# Altium project DC_CDI_Honda_CX500_rev2.0.PrjPcb
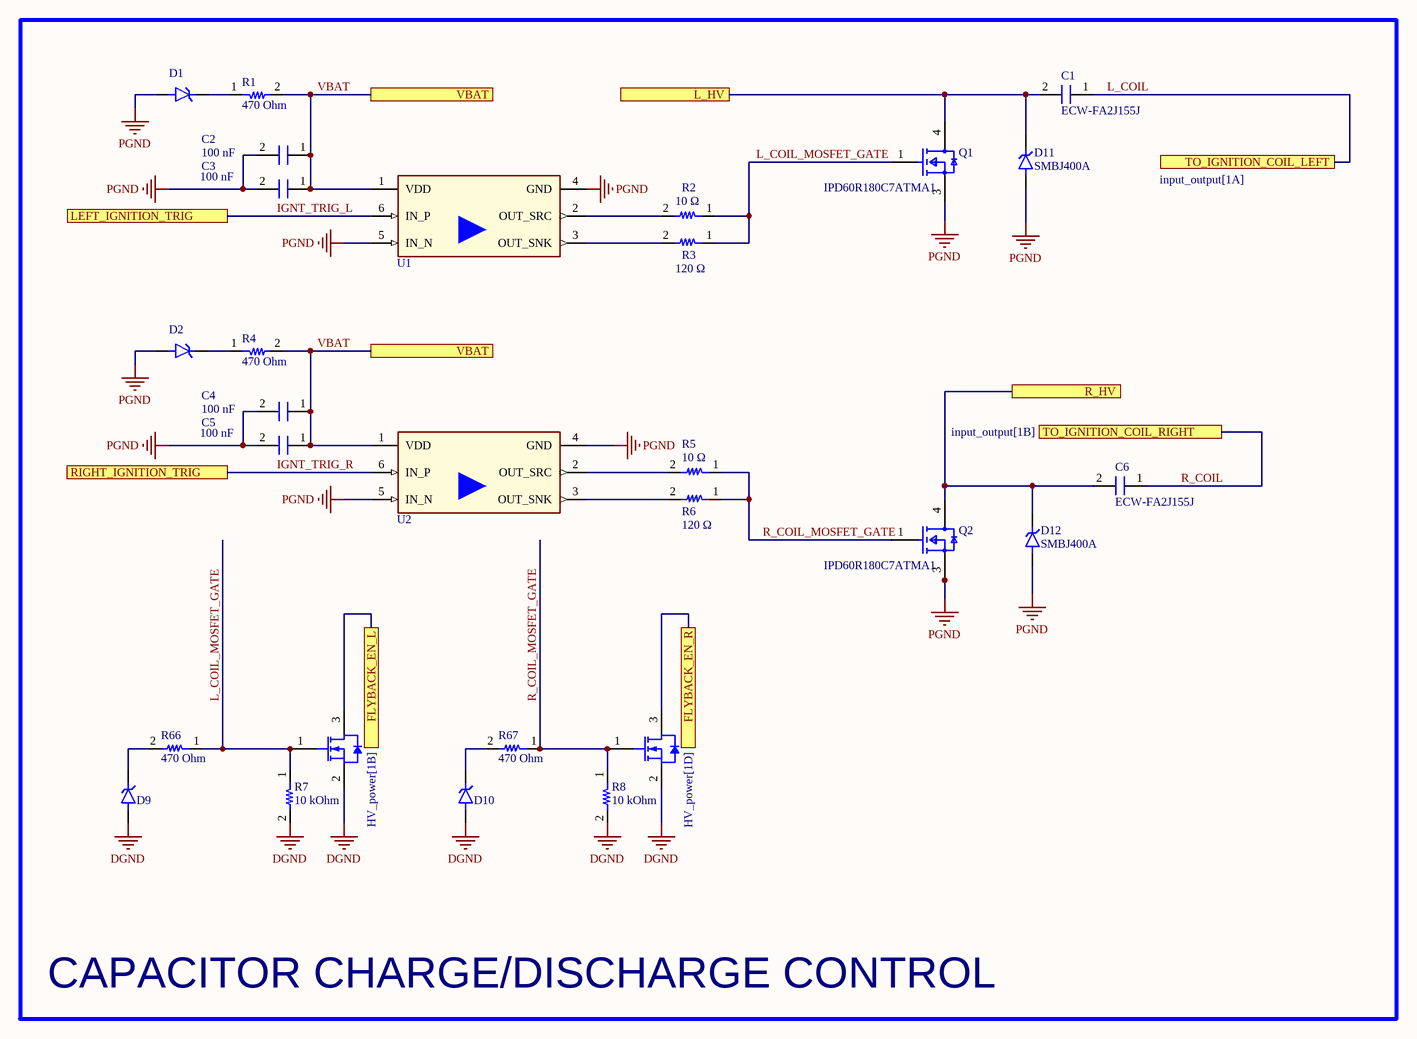
[diagram p0: cd_switching.SchDoc]
6 sheets, 162 parts. Net scope: flat (ports and power ports of the same name join across sheets).
Board file: dc_cdi_cx500.PcbDoc
Sheets:
  cd_switching.SchDoc
  input_output.SchDoc
  input_signal_conditioning.SchDoc
  logic.SchDoc
  HV_power.SchDoc
  LV_power.SchDoc

## Sheet cd_switching.SchDoc: Power Side
size A3; SheetNumber: 1; SheetTotal: 6

### Parts
C1  ECW-FA2J155J  [22,5mm_CAP]
C2  value 100 nF  [0603_FP]  (hidden comment: Capacitor_0603)
C3  value 100 nF  [0603_FP]  (hidden comment: Capacitor_0603)
C4  value 100 nF  [0603_FP]  (hidden comment: Capacitor_0603)
C5  value 100 nF  [0603_FP]  (hidden comment: Capacitor_0603)
C6  ECW-FA2J155J  [22,5mm_CAP]
D1  BZT52B15SH_RRG  [DIO_BZT52B15SH_RRG]  (value not drawn)
D2  BZT52B15SH_RRG  [DIO_BZT52B15SH_RRG]  (value not drawn)
D9  BZT52B15SH_RRG  [DIO_BZT52B15SH_RRG]  (value not drawn)
D10  BZT52B15SH_RRG  [DIO_BZT52B15SH_RRG]  (value not drawn)
D11  SMBJ400A  [DIOM5436X261N]
D12  SMBJ400A  [DIOM5436X261N]
Q1  IPD60R180C7ATMA1  [FP-PG-TO252-3-MFG]
Q2  IPD60R180C7ATMA1  [FP-PG-TO252-3-MFG]
Q3  MGSF1N03LT1G  [ONSC-SOT-23-3-318-08_V]  (value not drawn)
Q4  MGSF1N03LT1G  [ONSC-SOT-23-3-318-08_V]  (value not drawn)
R1  value 470 Ohm  [0603_FP]  (hidden comment: Resistor_0603)
R2  value 10 Ω  [0603_FP]  (hidden comment: Resistor_0603)
R3  value 120 Ω  [0603_FP]  (hidden comment: Resistor_0603)
R4  value 470 Ohm  [0603_FP]  (hidden comment: Resistor_0603)
R5  value 10 Ω  [0603_FP]  (hidden comment: Resistor_0603)
R6  value 120 Ω  [0603_FP]  (hidden comment: Resistor_0603)
R7  value 10 kOhm  [0402_fp]  (hidden comment: Resistor_0402)
R8  value 10 kOhm  [0402_fp]  (hidden comment: Resistor_0402)
R66  value 470 Ohm  [0603_FP]  (hidden comment: Resistor_0603)
R67  value 470 Ohm  [0603_FP]  (hidden comment: Resistor_0603)
U1  1EDN7511B  [SOT95P280X145-6N-7-V]  (value not drawn)
U2  1EDN7511B  [SOT95P280X145-6N-7-V]  (value not drawn)

### Blocks framed on the sheet
CAPACITOR CHARGE/DISCHARGE CONTROL: C1-C6 D1 D2 D9-D12 Q1-Q4 R1-R8 R66 R67 U1 U2

### Ports
FLYBACK_EN_L (see HV_power[1B]), FLYBACK_EN_R (see HV_power[1D]), L_HV (see HV_power[4A]), LEFT_IGNITION_TRIG (see logic[1A]), R_HV (see HV_power[4B]), RIGHT_IGNITION_TRIG (see logic[1B]), TO_IGNITION_COIL_LEFT (see input_output[1A]), TO_IGNITION_COIL_RIGHT (see input_output[1B]), VBAT (see cd_switching[3A], HV_power[1C], input_output[2D], LV_power[1B]), VBAT (see cd_switching[3B], HV_power[1C], input_output[2D], LV_power[1B])

### Nets
DGND: D9.2(A) D10.2(A) Q3.2(S) Q4.2(S) R7.2 R8.2
PGND: C2.2 C3.2 C4.2 C5.2 D1.2(A) D2.2(A) D11.2(A) D12.2(A) Q1.3(Source) Q2.3(Source) U1.4(GND) U1.5(IN_N) U2.4(GND) U2.5(IN_N)
FLYBACK_EN_L: Q3.3(D) ; port FLYBACK_EN_L
FLYBACK_EN_R: Q4.3(D) ; port FLYBACK_EN_R
IGNT_TRIG_L: U1.6(IN_P) ; port LEFT_IGNITION_TRIG
IGNT_TRIG_R: U2.6(IN_P) ; port RIGHT_IGNITION_TRIG
L_COIL: C1.1 ; port TO_IGNITION_COIL_LEFT
L_COIL_MOSFET_GATE: Q1.1(Gate) Q3.1(G) R2.1 R3.1 R7.1 R66.1
L_HV: C1.2 D11.1(K) Q1.4(Drain) ; port L_HV
R_COIL: C6.1 ; port TO_IGNITION_COIL_RIGHT
R_COIL_MOSFET_GATE: Q2.1(Gate) Q4.1(G) R5.1 R6.1 R8.1 R67.1
R_HV: C6.2 D12.1(K) Q2.4(Drain) ; port R_HV
VBAT: C2.1 C3.1 C4.1 C5.1 R1.2 R4.2 U1.1(VDD) U2.1(VDD) ; port VBAT
NetD1_1: D1.1(K) R1.1
NetD2_1: D2.1(K) R4.1
NetD9_1: D9.1(K) R66.2
NetD10_1: D10.1(K) R67.2
NetR2_2: R2.2 U1.2(OUT_SRC)
NetR3_2: R3.2 U1.3(OUT_SNK)
NetR5_2: R5.2 U2.2(OUT_SRC)
NetR6_2: R6.2 U2.3(OUT_SNK)

### Library data of the parts
C1 C6 = Capacitor_THT_22.5mm
C2-C5 = Capacitor_0603: Format: 0402; Package: 0402
D1 D2 D9 D10 = BZT52B15SH_RRG: SOD-323, 200mW, 2%, 15V, Zener Diode; MF: Taiwan Semiconductor Corporation; MP: BZT52B15SH RRG; SnapEDA_Link: https://www.snapeda.com/parts/BZT52B15SH%20RRG/Taiwan+Semiconductor+Corporation/view-part/?ref=snap; Package: SOD-323-2 Taiwan Semiconductor; Value: *; Check_prices: https://www.snapeda.com/parts/BZT52B15SH%20RRG/Taiwan+Semiconductor+Corporation/view-part/?ref=eda
D11 D12 = SMBJ400A: Pince 648V 900mA Ipp TVS Diode Surface Mount DO-214AA (SMBJ); MF: Littelfuse; SnapEDA_Link: https://www.snapeda.com/parts/SMBJ400A/Littelfuse/view-part/?ref=snap; Package: DO-214 Littelfuse; Value: *; MP: SMBJ400A; Check_prices: https://www.snapeda.com/parts/SMBJ400A/Littelfuse/view-part/?ref=eda
Q1 Q2 = CMP-00196-57372565-1: IPD60R180C7ATMA1 Trans MOSFET N-CH 600V 13A 3-Pin(2+Tab) DPAK T/R; Turn-Off Delay Time: 50ns; Input Capacitance: 1.08nF; On-State Resistance: 180mΩ; Max Junction Temperature (Tj): 150°C; Number of Channels: 1; Max Power Dissipation: 68W; Drain to Source Resistance: 155mΩ; Gate to Source Voltage (Vgs): 20V; Turn-On Delay Time: 9.3ns; Drain to Source Breakdown Voltage: 600V; RoHS: Compliant; Max Dual Supply Voltage: 600V; Lifecycle Status: Production; Max Operating Temperature: 150°C; Halogen Free: Halogen Free; Drain to Source Voltage (Vdss): 600V; Package Quantity: 2500; Mount: Surface Mount; Rds On Max: 180mΩ; NexarPartId: 57372565; Lead Free: Contains Lead; Height: 2.5mm; Packaging: Tape & Reel; Min Operating Temperature: -55°C; Continuous Drain Current (ID): 13A; Case/Package: TO-252-3; Power Dissipation: 68W
Q3 Q4 = CMP-1058-00778-1: Power MOSFET, 30 V, 2.1 A, Single N-Channel, 3-Pin SOT-23, Pb-Free, Tape and Reel; Manufacturer: On Semiconductor; VGS(th) Max (V): 2.4; Channel Polarity: N Channel; Ciss Typ (pF): 140; Crss Typ (pF): 40; Coss Typ (pF): 100; V(BR)DSS Min (V): 30; ID Max (A): 2.1; VGS Max (V): 20; ComponentLink1Description: Manufacturer URL; PartNumber: MGSF1N03LT1G; Packing: Tape and Reel; DatasheetVersion: Rev. 10; ComponentLink1URL: http://www.onsemi.com/; Mounting Technology: Surface Mount; PackageVersion: Rev. AP, 11/2009; PackageDescription: 3-Pin Small Outline Transistor, Body 2.92 x 1.3 mm, Pitch 0.95 mm; Package Type: SOT-23-3; ComponentLink3URL: http://www.onsemi.cn/pub_link/Collateral/318-08.PDF; RoHS: Pb-Free; ComponentLink3Description: Package Specification; ComponentLink2Description: Datasheet; Configuration: Single; PackageReference: SOT-23-3-318-08; ComponentLink2URL: http://www.onsemi.cn/pub_link/Collateral/MGSF1N03LT1-D.PDF
R1-R6 R66 R67 = Resistor_0603: Format: 0402; Package: 0402
R7 R8 = Resistor_0402: Format: 0402; Package: 0402
U1 U2 = 1EDN7511B: EiceDRIVER, Fast Single Channel 4A/8A Low-Side Gate Driver, UVLO - 4.2V; Manufacturer: Infineon Technologies; ManufacturerPartNumber: 1EDN7511B; PackageReference: PG-SOT23-6-2

## Sheet input_output.SchDoc
size A4; SheetNumber: 2; SheetTotal: 6
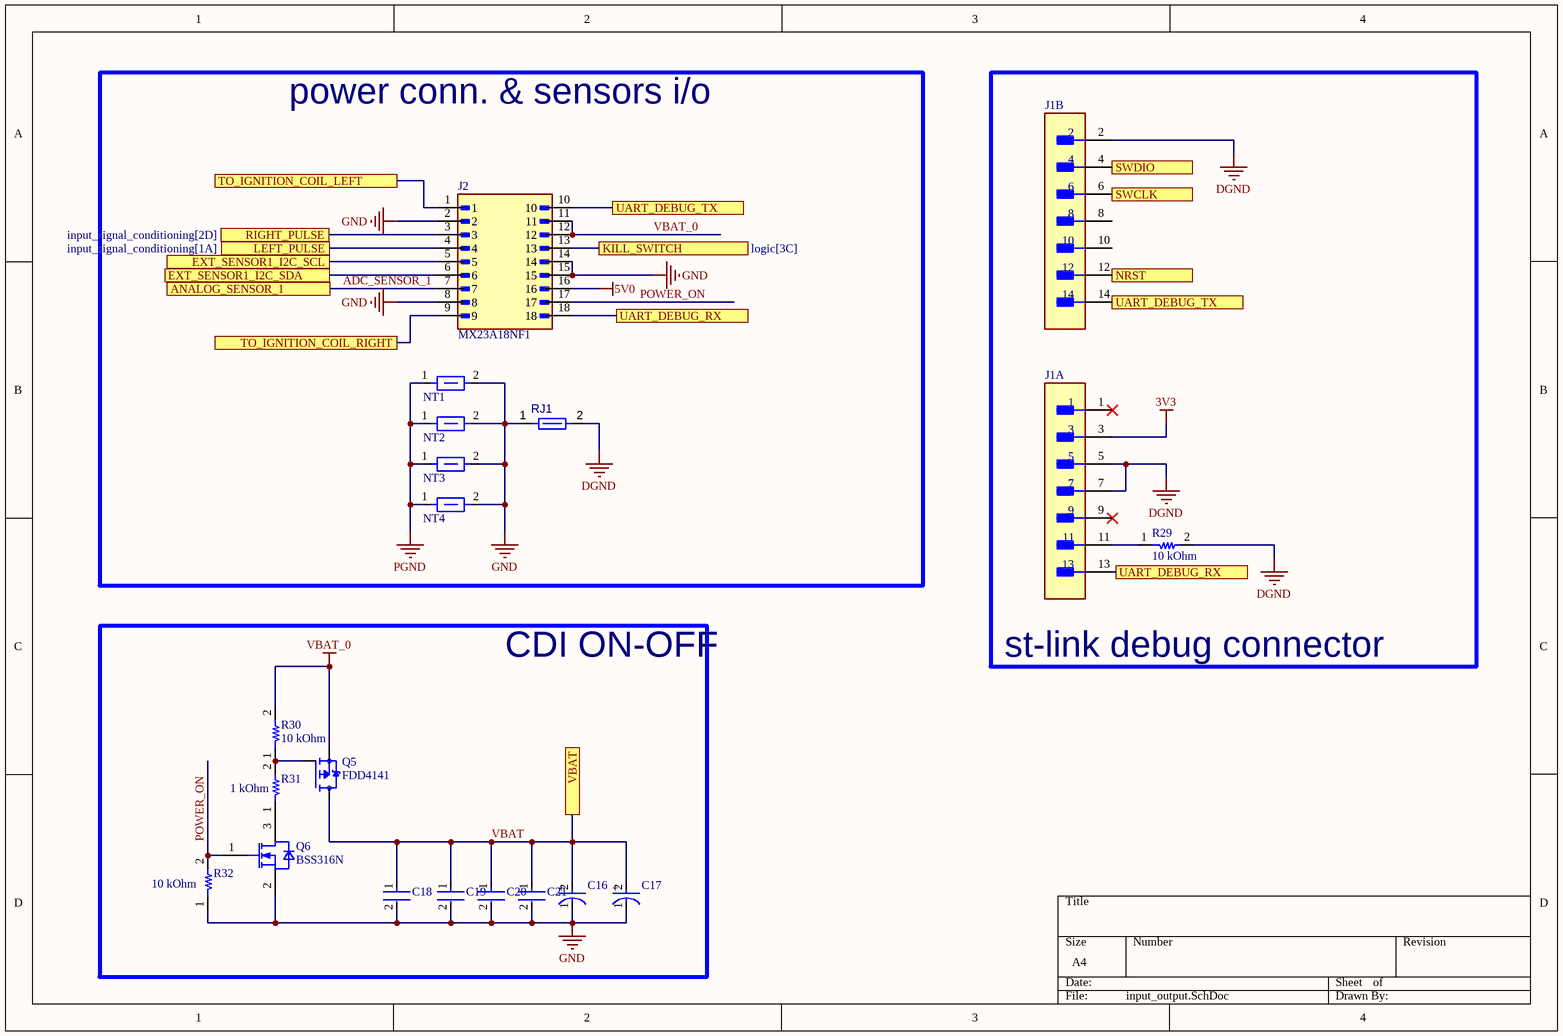
[diagram p1: input_output.SchDoc]

### Parts
C16  EEHZT1E221P  [FP-EEH-F-MFG]  (value not drawn)
C17  EEHZT1E221P  [FP-EEH-F-MFG]  (value not drawn)
C18  C1206X104J3GACTU  [FP-C1206X104J3GACTU-MFG]  (value not drawn)
C19  C1206X104J3GACTU  [FP-C1206X104J3GACTU-MFG]  (value not drawn)
C20  C1206X104J3GACTU  [FP-C1206X104J3GACTU-MFG]  (value not drawn)
C21  C1206X104J3GACTU  [FP-C1206X104J3GACTU-MFG]  (value not drawn)
J1  FTSH-107-01-F-DV-K  [FP-FTSH-107-01-F-DV-K-MFG]  (value not drawn)  (parts A,B of 2)
J2  MX23A18NF1  [JAE_MX23A18NF1]
NT1  GROUND_NET_TIE  [NET_TIE_GND]  (value not drawn)  (net tie, no BOM)
NT2  GROUND_NET_TIE  [NET_TIE_GND]  (value not drawn)  (net tie, no BOM)
NT3  GROUND_NET_TIE  [NET_TIE_GND]  (value not drawn)  (net tie, no BOM)
NT4  GROUND_NET_TIE  [NET_TIE_GND]  (value not drawn)  (net tie, no BOM)
Q5  FDD4141  [TO252]
Q6  BSS316N  [SOT95P260X110-3N]
R29  value 10 kOhm  [0603_FP]  (hidden comment: Resistor_0603)
R30  value 10 kOhm  [0603_FP]  (hidden comment: Resistor_0603)
R31  value 1 kOhm  [0603_FP]  (hidden comment: Resistor_0603)
R32  value 10 kOhm  [0603_FP]  (hidden comment: Resistor_0603)
RJ1  Net Tie 12x8mil  [SHORT06-FP]  (value not drawn)  (net tie, no BOM)

### Blocks framed on the sheet
power conn. & sensors i/o: J2 NT1-NT4 RJ1
st-link debug connector: J1 R29
CDI ON-OFF: C16-C21 Q5 Q6 R30-R32

### Ports
ANALOG_SENSOR_1 (see logic[1A]), EXT_SENSOR1_I2C_SCL (see logic[3A]), EXT_SENSOR1_I2C_SDA (see logic[3A]), KILL_SWITCH (see logic[3C]), LEFT_PULSE (see input_signal_conditioning[1A]), NRST (see logic[3B]), RIGHT_PULSE (see input_signal_conditioning[2D]), SWCLK (see logic[1B]), SWDIO (see logic[1B]), TO_IGNITION_COIL_LEFT (see cd_switching[6B]), TO_IGNITION_COIL_RIGHT (see cd_switching[6B]), UART_DEBUG_RX (see input_output[2B], logic[1B]), UART_DEBUG_RX (see input_output[3C], logic[1B]), UART_DEBUG_TX (see input_output[2A], logic[1B]), UART_DEBUG_TX (see input_output[3B], logic[1B]), VBAT (see cd_switching[3A], cd_switching[3B], HV_power[1C], LV_power[1B])

### Nets
3V3: J1.3
5V0: J2.16
DGND: J1.2 J1.5 J1.7 R29.2 RJ1.2
GND: C16.1(C) C17.1(C) C18.2 C19.2 C20.2 C21.2 J2.2 J2.8 J2.14 J2.15 NT1.2 NT2.2 NT3.2 NT4.2 Q6.2(SOURCE) R32.1 RJ1.1
PGND: NT1.1 NT2.1 NT3.1 NT4.1
VBAT_0: J2.11 J2.12 Q5.2(S) R30.2
ADC_SENSOR_1: J2.7 ; port ANALOG_SENSOR_1
EXT_SENSOR1_I2C_SCL: J2.5 ; port EXT_SENSOR1_I2C_SCL
EXT_SENSOR1_I2C_SDA: J2.6 ; port EXT_SENSOR1_I2C_SDA
KILL_SWITCH: J2.13 ; port KILL_SWITCH
L_COIL: J2.1 ; port TO_IGNITION_COIL_LEFT
LEFT_PULSE_P: J2.4 ; port LEFT_PULSE
NRST: J1.12 ; port NRST
POWER_ON: J2.17 Q6.1(GATE) R32.2
R_COIL: J2.9 ; port TO_IGNITION_COIL_RIGHT
RIGHT_PULSE_P: J2.3 ; port RIGHT_PULSE
SWCLK: J1.6 ; port SWCLK
SWDIO: J1.4 ; port SWDIO
UART_DEBUG_RX: J1.13 J2.18 ; port UART_DEBUG_RX
UART_DEBUG_TX: J1.14 J2.10 ; port UART_DEBUG_TX
VBAT: C16.2(A) C17.2(A) C18.1 C19.1 C20.1 C21.1 Q5.3(D) ; port VBAT
NetJ1_11: J1.11 R29.1
NetQ5_1: Q5.1(G) R30.1 R31.2
NetQ6_3: Q6.3(DRAIN) R31.1

Not connected (* = marked no-connect by the designer): J1 1* 8 9* 10

### Notes on the sheet
- (in symbol CMP-05428-000892-1) +

### Library data of the parts
C16 C17 = CMP-05428-000892-1: Conductive Polymer Hybrid Aluminum Electrolytic Capacitors 220uF ±20% 25V RADIAL SMT 8x10.2mm
C18-C21 = CMP-03020-034648-1: CAP CER 0.1UF 25V C0G/NP0 1206; RoHS Compliant: Yes
J1 = CMP-02766-001448-1: CONN HEADER SMD 14POS 1.27MM; Gender: Male; Connector Type: Male Pin; Number of Contacts: 14; Row Spacing: 0.05inch; Min Operating Temperature: -55°C; Package Quantity: 1; Lead Free: Lead Free; RoHS Compliant: Yes; Contact Material: Bronze; Contact Plating: Gold; Number of Rows: 2; Housing Material: Polymer; Contact Type: Male Pin; Series: FTSH; Max Operating Temperature: 125°C; Orientation: Straight; Number of Positions: 14; Pitch: 1.27mm; Housing Color: Black; Color: Black; Radiation Hardening: No; Length: 8.89mm; Termination: Solder; Packaging: Rail/Tube; Depth: 5.84mm; Mount: Surface Mount; Contact Mating Length: 0.12inch
J2 = MX23A18NF1: MF: JAE Electronics; SnapEDA_Link: https://www.snapeda.com/parts/MX23A18NF1/JAE+Electronics/view-part/?ref=snap; Package: None; Value: *; MP: MX23A18NF1; Check_prices: https://www.snapeda.com/parts/MX23A18NF1/JAE+Electronics/view-part/?ref=eda
Q5 = FDD4141: P-Channel 40V 10.8A (Ta), 50A (Tc) 2.4W (Ta), 69W (Tc) Surface Mount D-PAK (TO-252AA); MF: onsemi; SnapEDA_Link: https://www.snapeda.com/parts/FDD4141/Onsemi/view-part/?ref=snap; Package: TO-252-3 ON Semiconductor; Value: *; MP: FDD4141; Check_prices: https://www.snapeda.com/parts/FDD4141/Onsemi/view-part/?ref=eda
Q6 = BSS316N: Insulated-Gate Field-Effect Transistor (IGFET), N-Channel, Enhancement, Body Diode, Pin 1 Gate, 2 Source, 3 Drain, 3 Pins; Manufacturer: Infineon Technologies; ManufacturerPartNumber: BSS316N; PackageReference: PG-SOT23-3-5
R29-R32 = Resistor_0603: Format: 0402; Package: 0402
RJ1 = CMP-009-00121-2: Max Operating Temperature: 155°C; Pins: 2; Min Operating Temperature: -55°C

## Sheet input_signal_conditioning.SchDoc
size A4; SheetNumber: 3; SheetTotal: 6
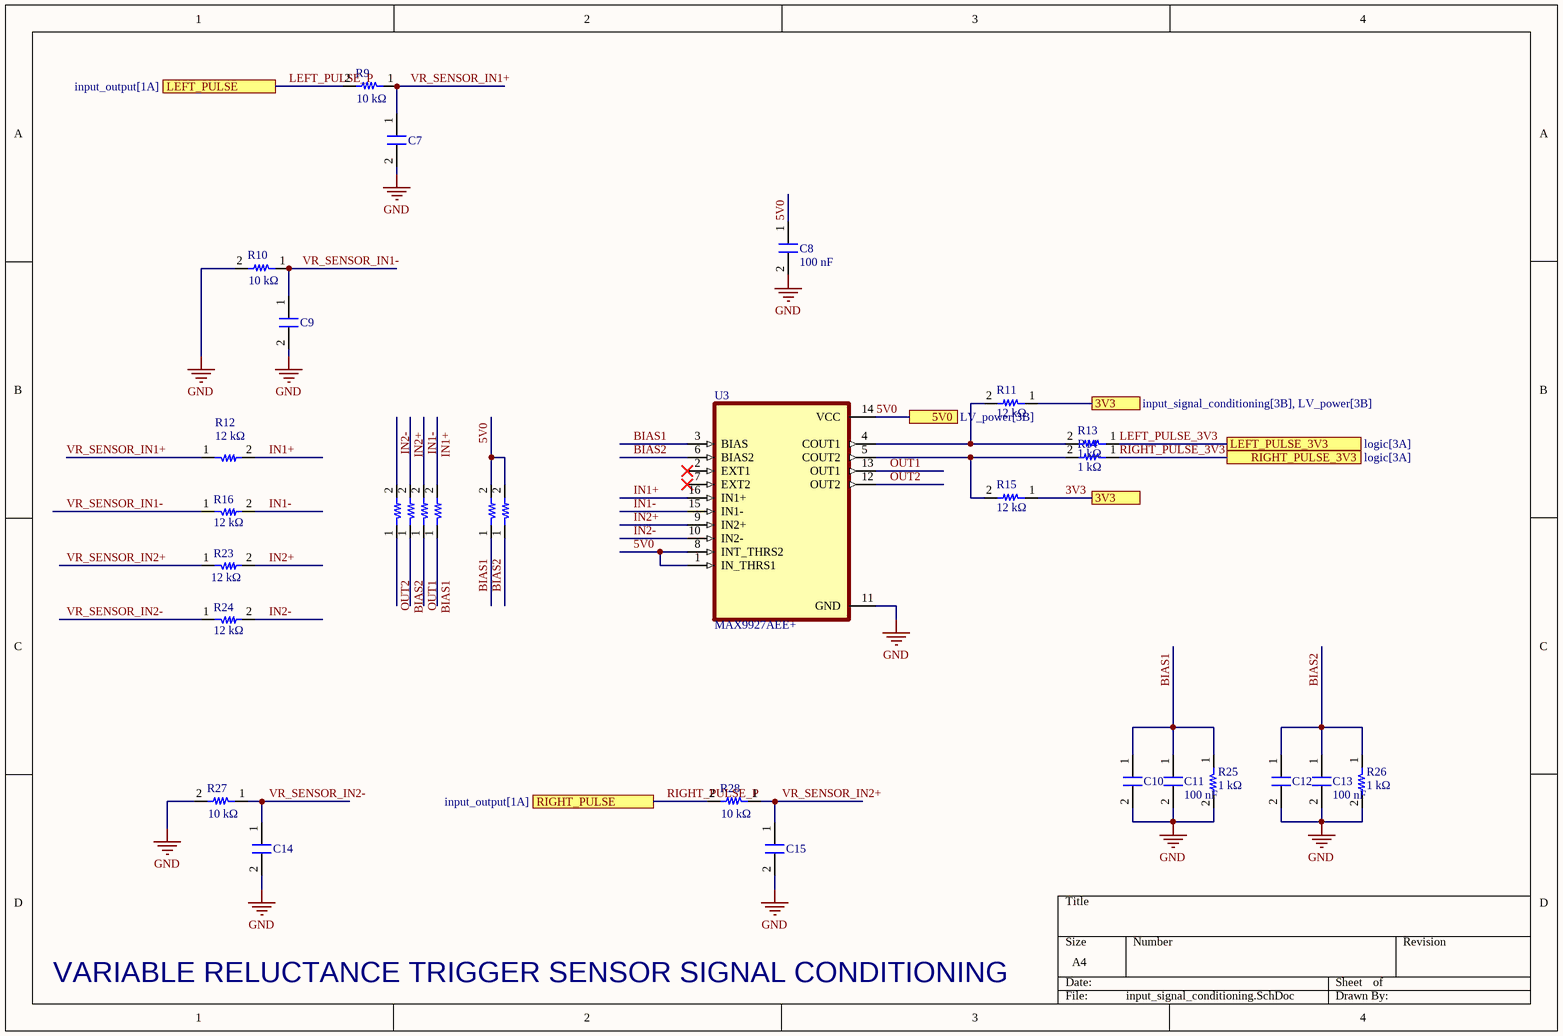
[diagram p2: input_signal_conditioning.SchDoc]

### Parts
C7  Capacitor_0402  [0402_fp]  (value not drawn)
C8  value 100 nF  [0402_fp]  (hidden comment: Capacitor_0402)
C9  Capacitor_0402  [0402_fp]  (value not drawn)
C10  Capacitor_0603  [0603_FP]  (value not drawn)
C11  value 100 nF  [0402_fp]  (hidden comment: Capacitor_0402)
C12  Capacitor_0603  [0603_FP]  (value not drawn)
C13  value 100 nF  [0402_fp]  (hidden comment: Capacitor_0402)
C14  Capacitor_0402  [0402_fp]  (value not drawn)
C15  Capacitor_0402  [0402_fp]  (value not drawn)
R9  value 10 kΩ  [0402_fp]  (hidden comment: Resistor_0402)
R10  value 10 kΩ  [0402_fp]  (hidden comment: Resistor_0402)
R11  value 12 kΩ  [0402_fp]  (hidden comment: Resistor_0402)
R12  value 12 kΩ  [0402_fp]  (hidden comment: Resistor_0402)
R13  value 1 kΩ  [0402_fp]  (hidden comment: Resistor_0402)
R14  value 1 kΩ  [0402_fp]  (hidden comment: Resistor_0402)
R15  value 12 kΩ  [0402_fp]  (hidden comment: Resistor_0402)
R16  value 12 kΩ  [0402_fp]  (hidden comment: Resistor_0402)
R17  Resistor_0402  [0402_fp]  (value not drawn)
R18  Resistor_0402  [0402_fp]  (value not drawn)
R19  Resistor_0402  [0402_fp]  (value not drawn)
R20  Resistor_0402  [0402_fp]  (value not drawn)
R21  Resistor_0402  [0402_fp]  (value not drawn)
R22  Resistor_0402  [0402_fp]  (value not drawn)
R23  value 12 kΩ  [0402_fp]  (hidden comment: Resistor_0402)
R24  value 12 kΩ  [0402_fp]  (hidden comment: Resistor_0402)
R25  value 1 kΩ  [0402_fp]  (hidden comment: Resistor_0402)
R26  value 1 kΩ  [0402_fp]  (hidden comment: Resistor_0402)
R27  value 10 kΩ  [0402_fp]  (hidden comment: Resistor_0402)
R28  value 10 kΩ  [0402_fp]  (hidden comment: Resistor_0402)
U3  MAX9927AEE+  [SOP63P602X175-16N]

### Ports
3V3 (see input_signal_conditioning[3B], LV_power[3B]), 5V0 (see LV_power[3B]), LEFT_PULSE (see input_output[1A]), LEFT_PULSE_3V3 (see logic[3A]), RIGHT_PULSE (see input_output[1A]), RIGHT_PULSE_3V3 (see logic[3A])

### Nets
3V3: R11.1 R15.1 ; port 3V3
5V0: C8.1 R21.2 R22.2 U3.1(IN_THRS1) U3.8(INT_THRS2) U3.14(VCC) ; port 5V0
GND: C7.2 C8.2 C9.2 C10.2 C11.2 C12.2 C13.2 C14.2 C15.2 R10.2 R25.2 R26.2 R27.2 U3.11(GND)
BIAS1: C10.1 C11.1 R20.1 R21.1 R25.1 U3.3(BIAS)
BIAS2: C12.1 C13.1 R18.1 R22.1 R26.1 U3.6(BIAS2)
IN1+: R12.2 R20.2 U3.16(IN1+)
IN1-: R16.2 R19.2 U3.15(IN1-)
IN2+: R18.2 R23.2 U3.9(IN2+)
IN2-: R17.2 R24.2 U3.10(IN2-)
LEFT_PULSE_3V3: R13.1 ; port LEFT_PULSE_3V3
LEFT_PULSE_P: R9.2 ; port LEFT_PULSE
OUT1: R19.1 U3.13(OUT1)
OUT2: R17.1 U3.12(OUT2)
RIGHT_PULSE_3V3: R14.1 ; port RIGHT_PULSE_3V3
RIGHT_PULSE_P: R28.2 ; port RIGHT_PULSE
VR_SENSOR_IN1+: C7.1 R9.1 R12.1
VR_SENSOR_IN1-: C9.1 R10.1 R16.1
VR_SENSOR_IN2+: C15.1 R23.1 R28.1
VR_SENSOR_IN2-: C14.1 R24.1 R27.1
NetR11_2: R11.2 R13.2 U3.4(COUT1)
NetR14_2: R14.2 R15.2 U3.5(COUT2)

Not connected (* = marked no-connect by the designer): U3 2(EXT1)* 7(EXT2)*

### Notes on the sheet
- VARIABLE RELUCTANCE TRIGGER SENSOR SIGNAL CONDITIONING

### Library data of the parts
C7 C9 C14 C15 = Capacitor_0402: Value: 1 nF; Format: 0402; Package: 0402
C8 C11 C13 = Capacitor_0402: Format: 0402; Package: 0402
C10 C12 = Capacitor_0603: Value: 10 uF; Format: 0402; Package: 0402
R9-R16 R23-R28 = Resistor_0402: Format: 0402; Package: 0402
R17-R20 = Resistor_0402: Value: 12 kΩ; Format: 0402; Package: 0402
R21 R22 = Resistor_0402: Value: 1 kΩ; Format: 0402; Package: 0402
U3 = MAX9927AEE+: Variable-Reluctance Sensor Interface with Differential Input and Adaptive Peak Threshold; MF: Analog Devices; SnapEDA_Link: https://www.snapeda.com/parts/MAX9927AEE+/Analog+Devices/view-part/?ref=snap; Package: QSOP-16 Maxim; Value: *; MP: MAX9927AEE+; Check_prices: https://www.snapeda.com/parts/MAX9927AEE+/Analog+Devices/view-part/?ref=eda

## Sheet logic.SchDoc
size A4; SheetNumber: 4; SheetTotal: 6
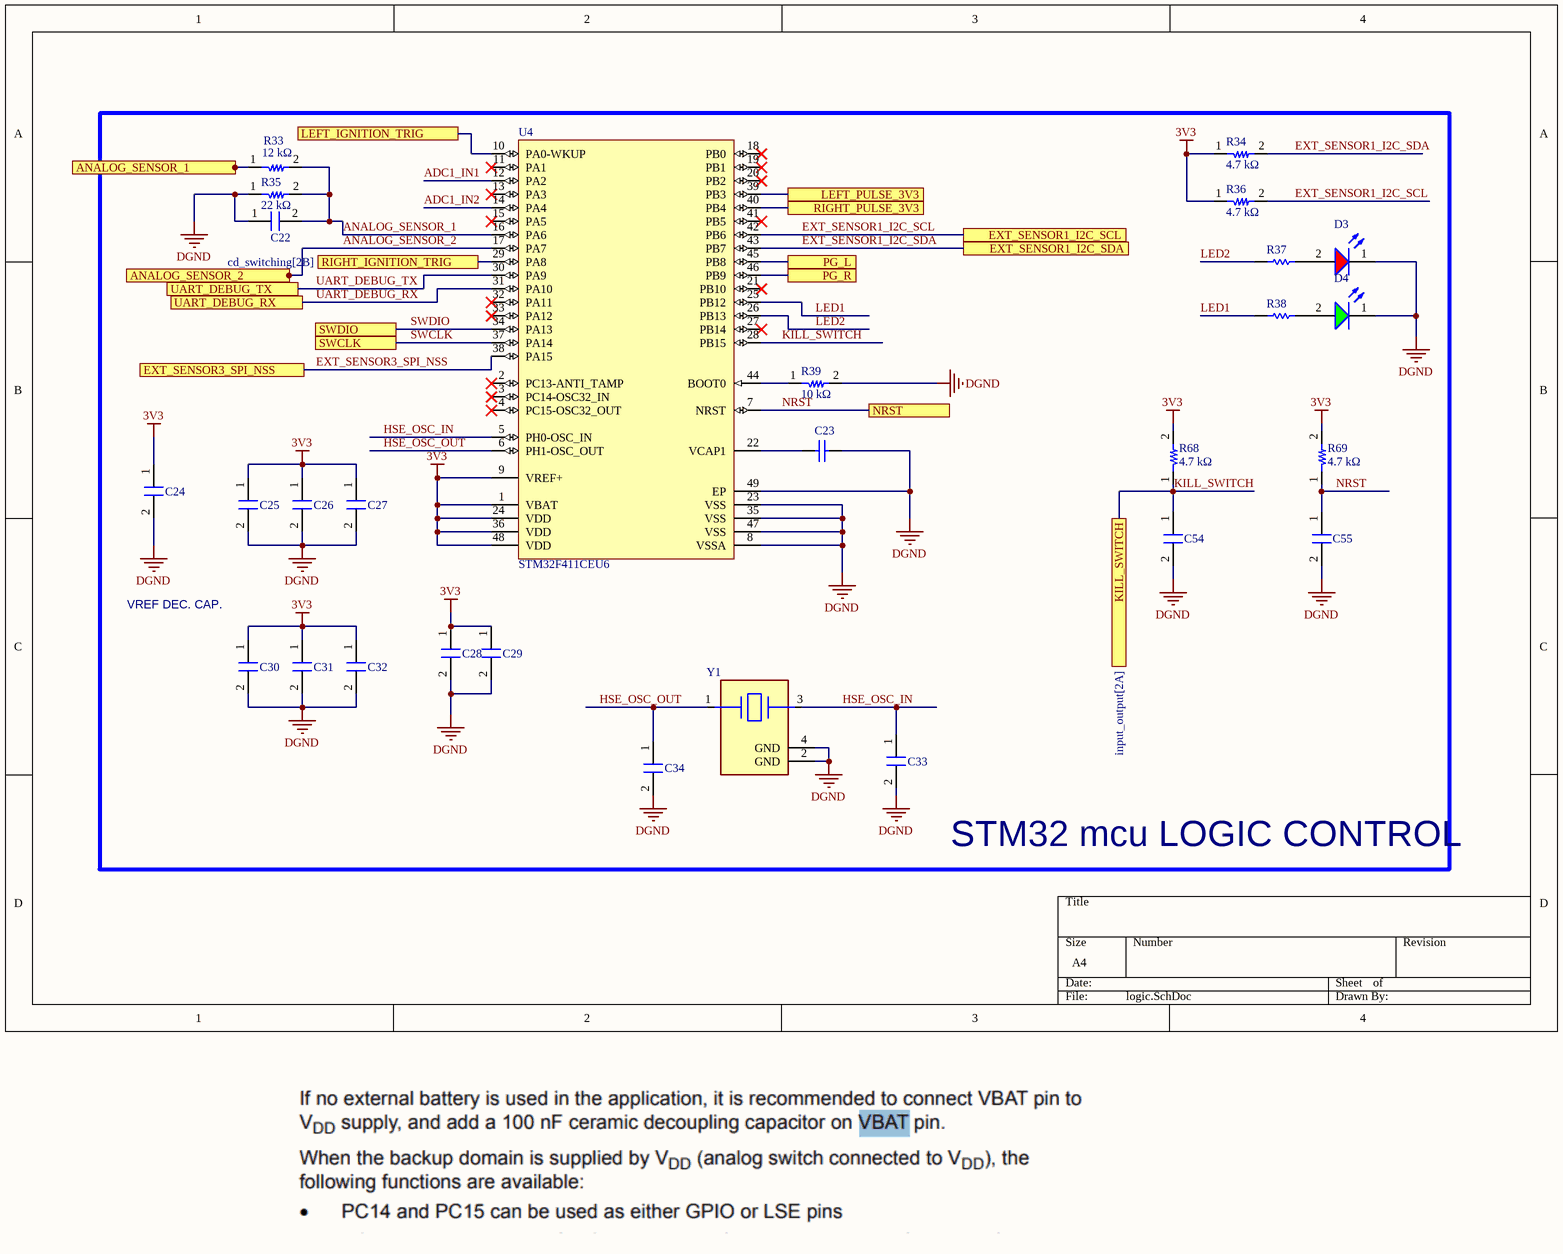
[diagram p3: logic.SchDoc]

### Parts
C22  Capacitor_0402  [0402_fp]  (value not drawn)
C23  0603ZD475MAT2A  [CAPC1608X90X35NL15T15]  (value not drawn)
C24  Capacitor_0402  [0402_fp]  (value not drawn)
C25  Capacitor_0402  [0402_fp]  (value not drawn)
C26  Capacitor_0402  [0402_fp]  (value not drawn)
C27  Capacitor_0402  [0402_fp]  (value not drawn)
C28  Capacitor_0402  [0402_fp]  (value not drawn)
C29  Capacitor_0402  [0402_fp]  (value not drawn)
C30  Capacitor_0402  [0402_fp]  (value not drawn)
C31  Capacitor_0402  [0402_fp]  (value not drawn)
C32  Capacitor_0402  [0402_fp]  (value not drawn)
C33  Capacitor_0603  [0603_FP]  (value not drawn)
C34  Capacitor_0603  [0603_FP]  (value not drawn)
C54  Capacitor_0402  [0402_fp]  (value not drawn)
C55  Capacitor_0402  [0402_fp]  (value not drawn)
D3  150080RS75000  [WL-SMCW_0805_150080xx75000]  (value not drawn)
D4  150080GS75000  [WL-SMCW_0805_150080xx75000]  (value not drawn)
R33  value 12 kΩ  [0402_fp]  (hidden comment: Resistor_0402)
R34  value 4.7 kΩ  [0402_fp]  (hidden comment: Resistor_0402)
R35  value 22 kΩ  [0402_fp]  (hidden comment: Resistor_0402)
R36  value 4.7 kΩ  [0402_fp]  (hidden comment: Resistor_0402)
R37  MCS04020D5600BE100  [RESC1005X37X20NL05T10]  (value not drawn)
R38  MCS04020D5600BE100  [RESC1005X37X20NL05T10]  (value not drawn)
R39  value 10 kΩ  [0402_fp]  (hidden comment: Resistor_0402)
R68  value 4.7 kΩ  [0402_fp]  (hidden comment: Resistor_0402)
R69  value 4.7 kΩ  [0402_fp]  (hidden comment: Resistor_0402)
U4  STM32F411CEU6  [STM-UFQFPN48_L]
Y1  NX3225GA-16.000M-STD-CRG-2  [FP-NX3225GA-MFG]  (value not drawn)

### Ports
ANALOG_SENSOR_1 (see input_output[1B]), ANALOG_SENSOR_2, EXT_SENSOR1_I2C_SCL (see input_output[1B]), EXT_SENSOR1_I2C_SDA (see input_output[1B]), EXT_SENSOR3_SPI_NSS, KILL_SWITCH (see input_output[2A]), LEFT_IGNITION_TRIG (see cd_switching[2B]), LEFT_PULSE_3V3 (see input_signal_conditioning[4B]), NRST (see input_output[3B]), PG_L (see HV_power[4B]), PG_R (see HV_power[4C]), RIGHT_IGNITION_TRIG (see cd_switching[2B]), RIGHT_PULSE_3V3 (see input_signal_conditioning[4B]), SWCLK (see input_output[3A]), SWDIO (see input_output[3A]), UART_DEBUG_RX (see input_output[2B], input_output[3C]), UART_DEBUG_TX (see input_output[2A], input_output[3B])

### Nets
3V3: C24.1 C25.1 C26.1 C27.1 C28.1 C29.1 C30.1 C31.1 C32.1 R34.1 R36.1 R68.2 R69.2 U4.1(VBAT) U4.9(VREF+) U4.24(VDD) U4.36(VDD) U4.48(VDD)
DGND: C22.1 C23.2 C24.2 C25.2 C26.2 C27.2 C28.2 C29.2 C30.2 C31.2 C32.2 C33.2 C34.2 C54.2 C55.2 D3.1(K) D4.1(K) R35.1 R39.2 U4.8(VSSA) U4.23(VSS) U4.35(VSS) U4.47(VSS) U4.49(EP) Y1.2(GND) Y1.4(GND)
ADC1_IN1: U4.12(PA2)
ADC1_IN2: U4.14(PA4)
ADC_SENSOR_1: R33.1 ; port ANALOG_SENSOR_1
ANALOG_SENSOR_1: C22.2 R33.2 R35.2 U4.16(PA6)
ANALOG_SENSOR_2: U4.17(PA7) ; port ANALOG_SENSOR_2
EXT_SENSOR1_I2C_SCL: R36.2 U4.42(PB6) ; port EXT_SENSOR1_I2C_SCL
EXT_SENSOR1_I2C_SDA: R34.2 U4.43(PB7) ; port EXT_SENSOR1_I2C_SDA
EXT_SENSOR3_SPI_NSS: U4.38(PA15) ; port EXT_SENSOR3_SPI_NSS
HSE_OSC_IN: C33.1 U4.5(PH0-OSC_IN) Y1.3
HSE_OSC_OUT: C34.1 U4.6(PH1-OSC_OUT) Y1.1
IGNT_TRIG_L: U4.10(PA0-WKUP) ; port LEFT_IGNITION_TRIG
IGNT_TRIG_R: U4.29(PA8) ; port RIGHT_IGNITION_TRIG
KILL_SWITCH: C54.1 R68.1 U4.28(PB15) ; port KILL_SWITCH
LED1: R38.1 U4.25(PB12)
LED2: R37.1 U4.26(PB13)
LEFT_PULSE_3V3: U4.39(PB3) ; port LEFT_PULSE_3V3
NRST: C55.1 R69.1 U4.7(NRST) ; port NRST
RIGHT_PULSE_3V3: U4.40(PB4) ; port RIGHT_PULSE_3V3
SWCLK: U4.37(PA14) ; port SWCLK
SWDIO: U4.34(PA13) ; port SWDIO
UART_DEBUG_RX: U4.31(PA10) ; port UART_DEBUG_RX
UART_DEBUG_TX: U4.30(PA9) ; port UART_DEBUG_TX
NetC23_1: C23.1 U4.22(VCAP1)
NetD3_2: D3.2(A) R37.2
NetD4_2: D4.2(A) R38.2
NetD6_1: U4.45(PB8) ; port PG_L
NetD8_1: U4.46(PB9) ; port PG_R
NetR39_1: R39.1 U4.44(BOOT0)

Not connected (* = marked no-connect by the designer): U4 2(PC13-ANTI_TAMP)* 3(PC14-OSC32_IN)* 4(PC15-OSC32_OUT)* 11(PA1)* 13(PA3)* 15(PA5)* 18(PB0)* 19(PB1)* 20(PB2)* 21(PB10)* 27(PB14)* 32(PA11)* 33(PA12)* 41(PB5)*

### Notes on the sheet
- VREF DEC. CAP.
- STM32 mcu LOGIC CONTROL

### Library data of the parts
C22 = Capacitor_0402: Value: 1 nF; Format: 0402; Package: 0402
C23 = CMP-1035-02787-2: Manufacturer: AVX Interconnect / Elco; Part Number: 0603ZD475MAT2A
C24 C54 C55 = Capacitor_0402: Value: 100 nF; Format: 0402; Package: 0402
C25-C32 = Capacitor_0402: Value: 10 nF; Format: 0402; Package: 0402
C33 C34 = Capacitor_0603: Value: 10 pF; Format: 0402; Package: 0402
D3 = CMP-1426-00011-3: LED Uni-Color Red 630nm 2-Pin Chip 0805(2012Metric) T/R; Viewing Angle: 140°; Max Junction Temperature (Tj): 95°C; Power Dissipation: 72mW; Forward Current: 100mA; Forward Voltage: 2V; Wavelength: 625nm; Test Current: 20mA; Max Reverse Voltage (DC): 5V; Luminous Intensity: 150mcd; Lens Style: Clear, Rectangular; REACH SVHC: Unknown; Height: 700µm; Case Code (Metric): 2012; Peak Wavelength: 630nm; Length: 2mm; Width: 1.25mm; RoHS: Compliant; Packaging: Tape and Reel; Dominant Wavelength: 625nm; Color: Red; Case Code (Imperial): 0805; Min Operating Temperature: -40°C; Mount: Surface Mount; Max Operating Temperature: 85°C; Case/Package: 0805
D4 = CMP-1426-00007-3: WURTH ELEKTRONIK - 150080GS75000 - LED, Green, SMD, 0805, 30 mA, 3.2 V, 520 nm; Forward Voltage: 3.2V; Viewing Angle: 140°; Power Dissipation: 105mW; Peak Wavelength: 515nm; Max Reverse Voltage (DC): 5V; Luminous Intensity: 450mcd; Wavelength: 525nm; Max Junction Temperature (Tj): 95°C; Forward Current: 100mA; Test Current: 20mA; Lens Style: Clear, Rectangular; Length: 2mm; Case/Package: 0805; Case Code (Metric): 2012; Color: Green; Height: 700µm; Width: 1.25mm; Packaging: Tape and Reel; Mount: Surface Mount; REACH SVHC: Unknown; RoHS: Compliant; Min Operating Temperature: -40°C; Reverse Voltage: 5V; Max Operating Temperature: 85°C; Dominant Wavelength: 525nm; Case Code (Imperial): 0805
R37 R38 = CMP-2002-02518-1: Manufacturer: Vishay BCcomponents; Part Number: MCS04020D5600BE100
U4 = CMP-0243-00165-1: ARM Cortex-M4 32-bit MCU+FPU, 512 KB Flash, 128 KB RAM, 36 I/Os, 48-Pin UFQFPN, -40 to 85 degC, Tray; Operating Frequency(F) (Processor speed) (MHz): 100; FLASH Size (Prog) (kB): 512; Internal RAM Size (kB): 128; I/Os (High Current): 36; Supply Voltage(Vcc) min (V): 1.7; Package Reference: 48-Pin Ultra Thin Fine Pitch Quad Flat No-Lead, 7 x 7 x 0.6 mm Body, 0.5 mm Pitch, Exposed Pad; ComponentLink1Description: Manufacturer URL; ComponentLink1URL: http://www.st.com/; Packing: Tray; Package Description: UFQFPN48; Core: ARM Cortex-M4; ComponentLink2Description: Datasheet; ComponentLink2URL: http://www.st.com/st-web-ui/static/active/en/resource/technical/document/datasheet/DM00115249.pdf; DatasheetVersion: Rev. 6; Mounting Technology: Surface Mount
Y1 = CMP-200220-000007-1: CRYSTAL 16.0000MHZ 8PF SMD; Frequency Stability: 30ppm; Frequency Tolerance: 20ppm; Frequency: 16MHz; ESR (Equivalent Series Resistance): 80R; Min Operating Temperature: -40°C; Mount: Surface Mount; Width: 0.098inch; Case/Package: SMD/SMT; Max Operating Temperature: 85°C; Number of Pins: 4; Length: 0.126inch; Load Capacitance: 8pF; Packaging: Tape and Reel; Package Quantity: 3000; Height: 0.035inch
R33-R36 R39 R68 R69 = Resistor_0402: Package: 0402

## Sheet HV_power.SchDoc
size A4; SheetNumber: 5; SheetTotal: 6
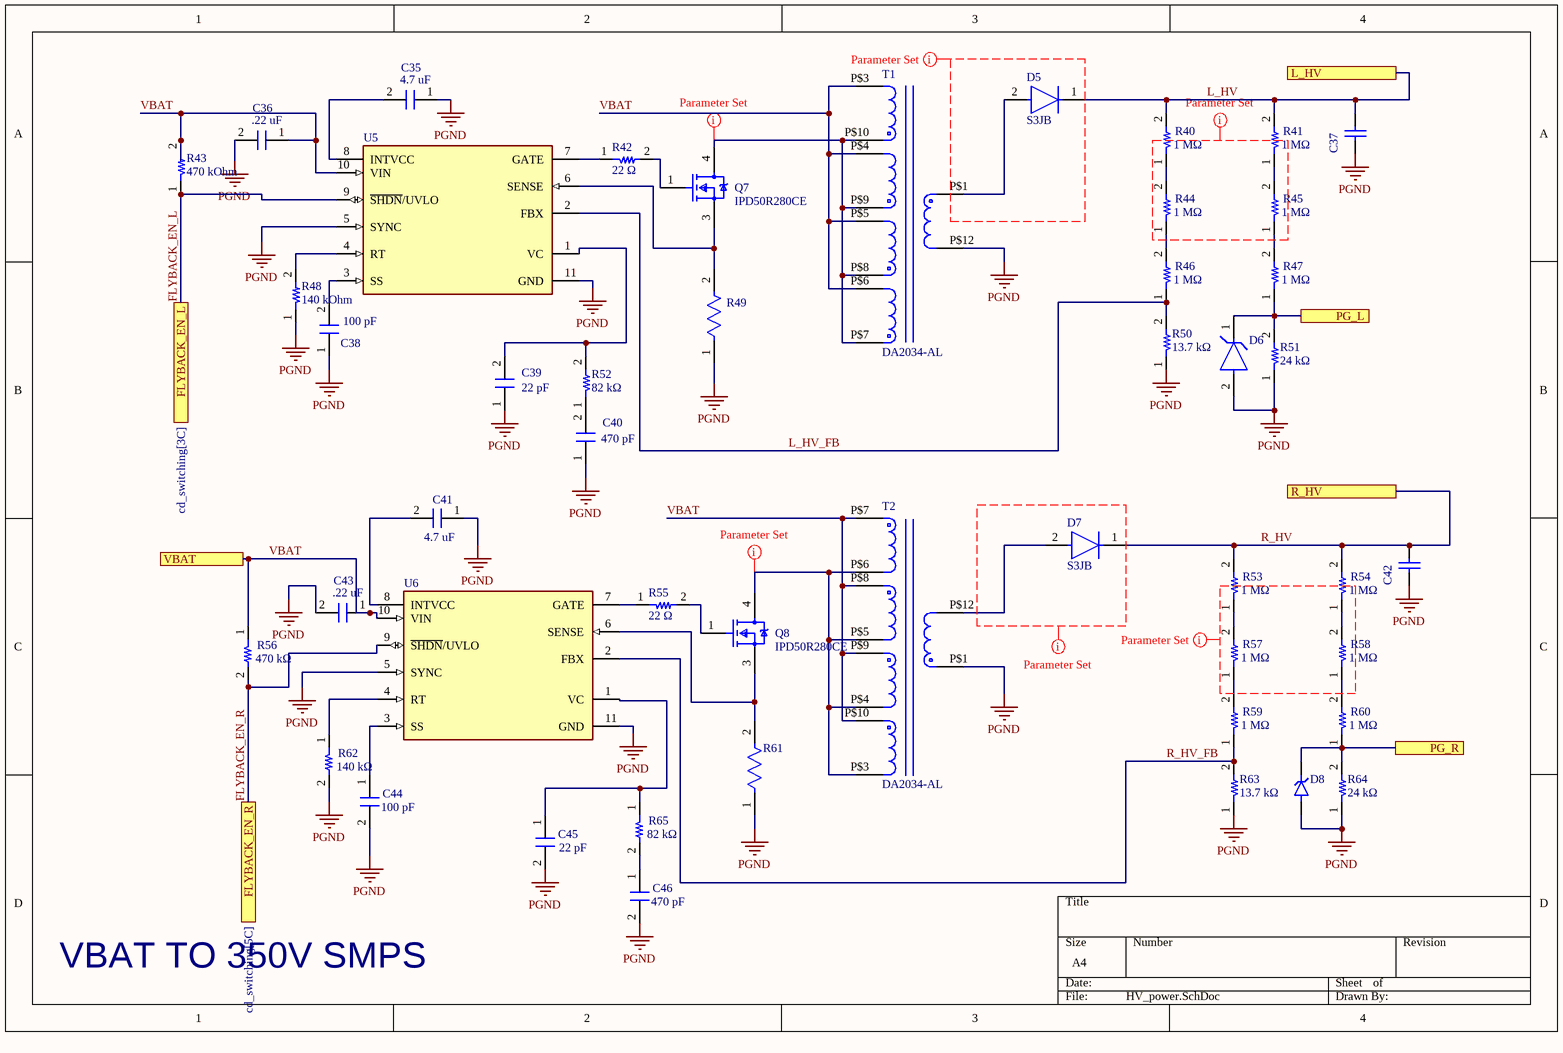
[diagram p4: HV_power.SchDoc]

### Parts
C35  value 4.7 uF  [0603_FP]  (hidden comment: GRM21BR61C475KA88L)
C36  value .22 uF  [0603_FP]  (hidden comment: GRM21BR61C475KA88L)
C37  890283323005CS  [WCAP-FTBP_L13W5.5H11]  (value not drawn)
C38  value 100 pF  [0603_FP]  (hidden comment: Capacitor_0603)
C39  value 22 pF  [0603_FP]  (hidden comment: Capacitor_0603)
C40  value 470 pF  [0603_FP]  (hidden comment: Capacitor_0603)
C41  value 4.7 uF  [0603_FP]  (hidden comment: Capacitor_0603)
C42  890283323005CS  [WCAP-FTBP_L13W5.5H11]  (value not drawn)
C43  value .22 uF  [0603_FP]  (hidden comment: GRM21BR61C475KA88L)
C44  value 100 pF  [0603_FP]  (hidden comment: Capacitor_0603)
C45  value 22 pF  [0603_FP]  (hidden comment: Capacitor_0603)
C46  value 470 pF  [0603_FP]  (hidden comment: Capacitor_0603)
D5  S3JB  [FP-403AF-MFG]
D6  CZRQR3V3B-HF  [FP-0402-SOD-923F-MFG]  (value not drawn)
D7  S3JB  [FP-403AF-MFG]
D8  BZT52B15SH_RRG  [DIO_BZT52B15SH_RRG]  (value not drawn)
Q7  IPD50R280CE  [FP-PG-TO252-3-MFG]
Q8  IPD50R280CE  [FP-PG-TO252-3-MFG]
R40  value 1 MΩ  [0805_FP]  (hidden comment: R_0805)
R41  value 1 MΩ  [0805_FP]  (hidden comment: R_0805)
R42  value 22 Ω  [0603_FP]  (hidden comment: Resistor_0603)
R43  value 470 kOhm  [0603_FP]  (hidden comment: Resistor_0603)
R44  value 1 MΩ  [0805_FP]  (hidden comment: R_0805)
R45  value 1 MΩ  [0805_FP]  (hidden comment: R_0805)
R46  value 1 MΩ  [0805_FP]  (hidden comment: R_0805)
R47  value 1 MΩ  [0805_FP]  (hidden comment: R_0805)
R48  value 140 kOhm  [0603_FP]  (hidden comment: Resistor_0603)
R49  CSRN2010FK20L0  [FP-CSRN2010-IPC_B]  (value not drawn)
R50  value 13.7 kΩ  [0805_FP]  (hidden comment: R_0805)
R51  value 24 kΩ  [0805_FP]  (hidden comment: R_0805)
R52  value 82 kΩ  [0603_FP]  (hidden comment: Resistor_0603)
R53  value 1 MΩ  [0805_FP]  (hidden comment: R_0805)
R54  value 1 MΩ  [0805_FP]  (hidden comment: R_0805)
R55  value 22 Ω  [0603_FP]  (hidden comment: Resistor_0603)
R56  value 470 kΩ  [0603_FP]  (hidden comment: Resistor_0603)
R57  value 1 MΩ  [0805_FP]  (hidden comment: R_0805)
R58  value 1 MΩ  [0805_FP]  (hidden comment: R_0805)
R59  value 1 MΩ  [0805_FP]  (hidden comment: R_0805)
R60  value 1 MΩ  [0805_FP]  (hidden comment: R_0805)
R61  CSRN2010FK20L0  [FP-CSRN2010-IPC_B]  (value not drawn)
R62  value 140 kΩ  [0603_FP]  (hidden comment: Resistor_0603)
R63  value 13.7 kΩ  [0805_FP]  (hidden comment: R_0805)
R64  value 24 kΩ  [0805_FP]  (hidden comment: R_0805)
R65  value 82 kΩ  [0603_FP]  (hidden comment: Resistor_0603)
T1  DA2034-AL  [DA2034-AL]
T2  DA2034-AL  [DA2034-AL]
U5  LT3758EDD#PBF  [FP-DD-10-05-08-1699-IPC_B]  (value not drawn)
U6  LT3758EDD#PBF  [FP-DD-10-05-08-1699-IPC_B]  (value not drawn)

### Ports
FLYBACK_EN_L (see cd_switching[3C]), FLYBACK_EN_R (see cd_switching[5C]), L_HV (see cd_switching[4A]), PG_L (see logic[3B]), PG_R (see logic[3B]), R_HV (see cd_switching[6B]), VBAT (see cd_switching[3A], cd_switching[3B], input_output[2D], LV_power[1B])

### Nets
PGND: C35.1 C36.2 C37.1 C38.1 C39.1 C40.1 C41.1 C42.1 C43.2 C44.2 C45.2 C46.2 D6.2(A) D8.2(A) R48.1 R49.1 R50.1 R51.1 R61.1 R62.2 R63.1 R64.1 T1.P$12 T2.P$1 U5.5(SYNC) U5.11(GND) U6.5(SYNC) U6.11(GND)
FLYBACK_EN_L: R43.1 U5.9(~{SHDN}/UVLO) ; port FLYBACK_EN_L
FLYBACK_EN_R: R56.2 U6.9(~{SHDN}/UVLO) ; port FLYBACK_EN_R
L_HV: C37.2 D5.1(C) R40.2 R41.2 ; port L_HV
L_HV_FB: R46.1 R50.2 U5.2(FBX)
R_HV: C42.2 D7.1(C) R53.2 R54.2 ; port R_HV
R_HV_FB: R59.1 R63.2 U6.2(FBX)
VBAT: C36.1 C43.1 R43.2 R56.1 T1.P$3 T1.P$4 T1.P$5 T1.P$6 T2.P$7 T2.P$8 T2.P$9 T2.P$10 U5.10(VIN) U6.10(VIN) ; port VBAT
NetC35_2: C35.2 U5.8(INTVCC)
NetC38_2: C38.2 U5.3(SS)
NetC39_2: C39.2 R52.2 U5.1(VC)
NetC40_2: C40.2 R52.1
NetC41_2: C41.2 U6.8(INTVCC)
NetC44_1: C44.1 U6.3(SS)
NetC45_1: C45.1 R65.1 U6.1(VC)
NetC46_1: C46.1 R65.2
NetD5_2: D5.2(A) T1.P$1
NetD6_1: D6.1(C) R47.1 R51.2 ; port PG_L
NetD7_2: D7.2(A) T2.P$12
NetD8_1: D8.1(K) R60.1 R64.2 ; port PG_R
NetQ7_1: Q7.1(GATE) R42.2
NetQ7_3: Q7.3(SOURCE) R49.2 U5.6(SENSE)
NetQ7_4: Q7.4(DRAIN) T1.P$7 T1.P$8 T1.P$9 T1.P$10
NetQ8_1: Q8.1(GATE) R55.2
NetQ8_3: Q8.3(SOURCE) R61.2 U6.6(SENSE)
NetQ8_4: Q8.4(DRAIN) T2.P$3 T2.P$4 T2.P$5 T2.P$6
NetR40_1: R40.1 R44.2
NetR41_1: R41.1 R45.2
NetR42_1: R42.1 U5.7(GATE)
NetR44_1: R44.1 R46.2
NetR45_1: R45.1 R47.2
NetR48_2: R48.2 U5.4(RT)
NetR53_1: R53.1 R57.2
NetR54_1: R54.1 R58.2
NetR55_1: R55.1 U6.7(GATE)
NetR57_1: R57.1 R59.2
NetR58_1: R58.1 R60.2
NetR62_1: R62.1 U6.4(RT)

### Layout directives
net class HV_NETS: (no net found under the mark), NetQ7_4, NetQ8_4
net class FB_NETS: (no net found under the mark)

### Notes on the sheet
- VBAT TO 350V SMPS

### Library data of the parts
C35 C36 C38-C41 C43-C46 = Capacitor_0603: Format: 0402; Package: 0402
C37 C42 = CMP-03913-89437304-2: Cap, 0.1Uf, 400V, Film, Radial Rohs Compliant: Yes; Capacitance: 100nF; ESR (Equivalent Series Resistance): 38.46mΩ; Insulation Resistance: 30GΩ; Pin Length: 4mm; Pitch: 10mm; Height: 11mm; Width: 5.5mm; Length: 13mm; RoHS: Compliant; Voltage Rating: 400V; Packaging: Carton
D5 D7 = CMP-00278-84331306-1: S3JB Rectifier Diode, 1 Phase, 1 Element, 3A, 600V V(RRM), Silicon, DO-214AA; Manufacturer Lifecycle Status: ACTIVE; Element Configuration: Single; Max Junction Temperature (Tj): 150°C; Peak Reverse Current: 10µA; Capacitance: 40pF; Reverse Recovery Time: 1.5µs; Max Forward Surge Current (Ifsm): 80A; Mount: Surface Mount; Max Reverse Voltage (DC): 600V; RoHS: Compliant; Packaging: Cut Tape; Weight: 180mg; Schedule B: 8541100080, 8541100080; Average Rectified Current: 3A; Height: 2.65mm; Min Operating Temperature: -55°C; Reverse Voltage: 600V; Max Repetitive Reverse Voltage (Vrrm): 600V; Lifecycle Status: Production; Case/Package: SMB; Forward Current: 3A; Max Operating Temperature: 150°C; NexarPartId: 84331306
D6 = CMP-20229-000002-1: DIODE ZENER 3.3V 125MW 0402; Element Configuration: Single; Max Reverse Leakage Current: 25uA; Tolerance: 5%; Zener Current: 5mA; Impedance: 95R; Mount: Surface Mount; Case Code (Metric): 1006; Packaging: Cut Tape; Max Power Dissipation: 125mW; Case Code (Imperial): 0402; Power Dissipation: 125mW; Zener Voltage: 3.3V; Package Quantity: 5000; Min Operating Temperature: -55°C; Max Operating Temperature: 125°C; Case/Package: 0402
D8 = BZT52B15SH_RRG: as D1 on sheet cd_switching; SnapEDA_Link: https://www.snapeda.com/parts/BZT52B15SH%20RRG/Taiwan+Semiconductor+Corporation/view-part/?ref=snap; Package: SOD-323-2 Taiwan Semiconductor; Value: *; Check_prices: https://www.snapeda.com/parts/BZT52B15SH%20RRG/Taiwan+Semiconductor+Corporation/view-part/?ref=eda
Q7 Q8 = CMP-32901-000143-1: MOSFET N-CH 30V 161A DPAK; Manufacturer Part Number: IRLR7843TRPBF; Manufacturer: Infineon; Drain To Source Resistance: 3.2mΩ; Depletion Mode: False; Reverse Recovery Time: 39ns; Reverse Recovery Charge: 36nC; Threshold Vgs Max: 2.3V; Rthja Max: 50°C/W; Threshold Vgs Min: 1.4V; Power Dissipation: 140W; Pulse Drain Current: 620A; Input Capacitace At Vds: 4380pF @ 15V; Turn On Delay Time: 25ns; Gate To Source Voltage: 20V; Max Forward Diode Voltage: 1V; Gate Charge At Vgs: 34nC @ 4.5V; Max Junction Temp: +175°C; Number Of Channels: 1; Turn Off Delay Time: 34ns; ComponentLink2URL: https://www.infineon.com/dgdl/irlr7843pbf.pdf?fileId=5546d462533600a40153566de53526d8; Temperature Range High: +175°C; Octopart: https://octopart.com/irlr7843trpbf-infineon-65875062; Temperature: -55°C to +175°C; Device Class L3: MOSFETs; Category: Trans; Package: PG-TO252-3; Footprint Url: https://www.infineon.com/cms/en/product/packages/PG-TO252/PG-TO252-3-901/; Continuous Drain Current: 161A; Digikey Description: MOSFET N-CH 30V 161A DPAK; Automotive: No; Lead Free: Yes; Drain To Source Breakdown Voltage: 30V; Height: 2.52mm; Temperature Range Low: -55°C; RoHS: TRUE; Number Of N Channels: 1; Drain To Source Voltage: 30V; ComponentLink2Description: Datasheet; Device Class L2: Transistors; Device Class L1: Discrete Semiconductors
R42 R43 R48 R52 R55 R56 R62 R65 = Resistor_0603: Format: 0402; Package: 0402
R49 R61 = CMP-26527-002648-1: Res Thick Film 2010 20mΩ 1% 1W ±250ppm/°C Molded SMD Plastic T/R; Resistance: 12 mΩ; Number of Terminations: 2; Radiation Hardening: No; Series: CSRN; Length: 0.197inch; RoHS Compliant: Yes; Max Operating Temperature: 155°C; Packaging: Tape and Reel; Resistor Type: Thick Film; Tolerance: 1%; Mount: Surface Mount; Height: 0.03inch; Package Quantity: 1; Case Code (Imperial): 2010; Case Code (Metric): 5025; Max Power Dissipation: 1W; Temperature Coefficient: 250ppm/°C; Case/Package: 2010; Size Code: 2010; Width: 0.097inch; Contact Plating: Tin; Power Rating: 1W; Min Operating Temperature: -55°C; Lead Free: Lead Free
T1 T2 = DA2034-AL: Flyback Transformer for Linear Technology LT3750  Reference: http://www.coilcraft.com/da2032.cfm  L - 10 uH TurnsRatio Pri:Sec - 1:10 Ipeak - 10.0 A Interwinding capacitance - 128 pF DCRmax: Pri - 0.018, Sec - 1.75 Ohms; Package: None; Price: None; Value: *; MP: DA2034-AL; Availability: Unavailable
U5 U6 = CMP-09139-000585-1: IC REG CTRLR MULT TOPOLOGY 10DFN; Max Input Voltage: 100V; Number of Outputs: 1; Max Output Voltage: 12V; Max Output Current: 1.2A; Max Frequency: 1MHz; Min Input Voltage: 5.5V; Topology: Boost; Mount: Surface Mount; Min Operating Temperature: -40°C; REACH SVHC: No SVHC; Max Operating Temperature: 125°C; Output Voltage: 100V; Max Supply Voltage: 100V; Switching Frequency: 1MHz; Case/Package: DFN; Package Quantity: 121; Series: -; Packaging: Rail/Tube; RoHS Compliant: Yes; Width: 3mm; Min Supply Voltage: 5.5V; Number of Pins: 10; Length: 3mm; Height: 0.7mm

## Sheet LV_power.SchDoc
size A4; SheetNumber: 6; SheetTotal: 6
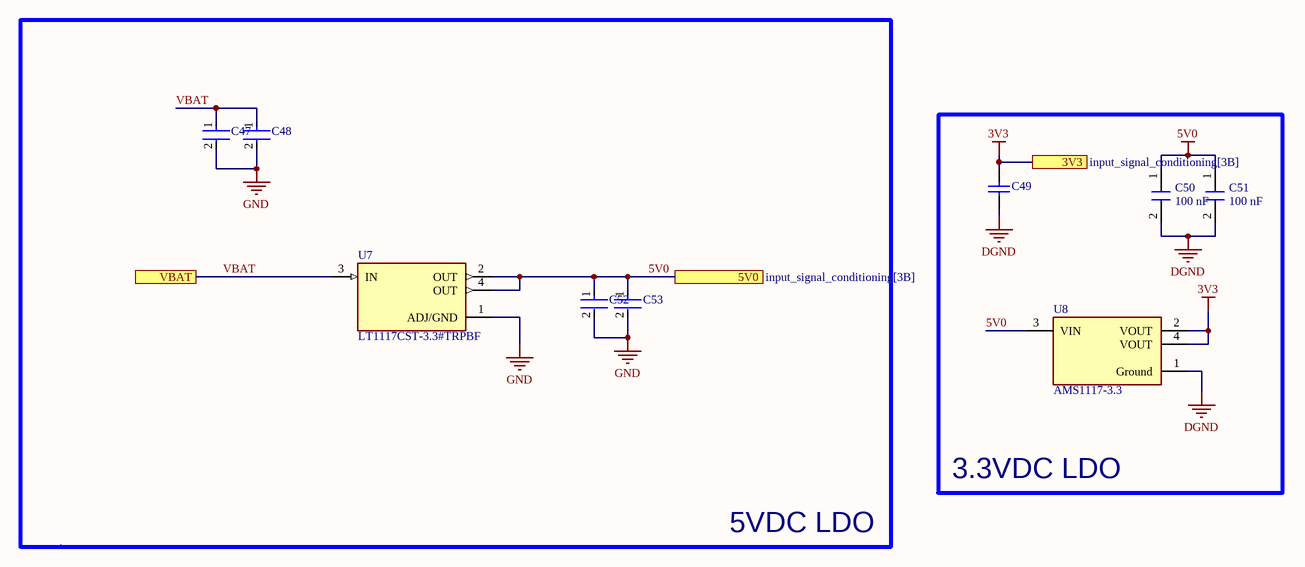
[diagram p5: LV_power.SchDoc]

### Parts
C47  CC0805MKX5R8BB226  [FP-CC0805-0_2-1_45-IPC_C]  (value not drawn)
C48  CC0805MKX5R8BB226  [FP-CC0805-0_2-1_45-IPC_C]  (value not drawn)
C49  0805ZG106ZAT2A  [CAPC2013X152X50NL20T25]  (value not drawn)
C50  value 100 nF  [0603_FP]  (hidden comment: Capacitor_0603)
C51  value 100 nF  [0603_FP]  (hidden comment: Capacitor_0603)
C52  GRM21BR61A476ME15K  [FP-GRM21B-0_2-e0_2_0_7-IPC_B]  (value not drawn)
C53  GRM21BR61A476ME15K  [FP-GRM21B-0_2-e0_2_0_7-IPC_B]  (value not drawn)
U7  LT1117CST-3.3#TRPBF  [REG_LT1117CST-3.3#TRPBF]
U8  AMS1117-3.3  [FP-AMS1117-IPC_C]

### Blocks framed on the sheet
5VDC LDO: C47 C48 C52 C53 U7
3.3VDC LDO: C49-C51 U8

### Ports
3V3 (see input_signal_conditioning[3B]), 5V0 (see input_signal_conditioning[3B]), VBAT (see cd_switching[3A], cd_switching[3B], HV_power[1C], input_output[2D])

### Nets
3V3: C49.2 U8.2(VOUT) U8.4(VOUT) ; port 3V3
5V0: C50.1 C51.1 C52.1 C53.1 U7.2(OUT) U7.4(OUT) U8.3(VIN) ; port 5V0
DGND: C49.1 C50.2 C51.2 U8.1(Ground)
GND: C47.2 C48.2 C52.2 C53.2 U7.1(ADJ/GND)
VBAT: C47.1 C48.1 U7.3(IN) ; port VBAT

### Library data of the parts
C47 C48 = CMP-03422-001497-1: CAP CER 22UF 25V X5R 0805; Tolerance: 20%; Max Operating Temperature: 85°C; Dielectric: X5R; Termination: SMD/SMT; Voltage Rating: 25V; Width: 0.049inch; Min Operating Temperature: -55°C; Case/Package: 0805; Lead Free: Lead Free; RoHS Compliant: Yes; Weight: 0.000194oz; Voltage Rating (DC): 25V; Capacitance: 22uF; Length: 0.079inch; Halogen Free: Halogen Free; Height: 1.25mm; Packaging: Tape and Reel; Package Quantity: 3000; Case Code (Metric): 2012; Thickness: 0.057inch; Case Code (Imperial): 0805; Mount: Surface Mount
C49 = CMP-2007-04523-1: Manufacturer: AVX Interconnect / Elco; Part Number: 0805ZG106ZAT2A
C50 C51 = Capacitor_0603: Format: 0402; Package: 0402
C52 C53 = CMP-06035-042633-1: Chip Multilayer Ceramic Capacitors for General Purpose, 0805, 47uF, X5R, 15%, 20%, 10V; Min Operating Temperature: -55°C; Max Operating Temperature: 85°C; Length: 0.079inch; Case Code (Imperial): 0805; Tolerance: 20%; Mount: Surface Mount; Voltage Rating (DC): 10V; Termination: SMD/SMT; Voltage Rating: 10V; Weight: 0.000335oz; Package Quantity: 10000; Dielectric: X5R; Thickness: 0.057inch; Capacitance: 47uF; Case/Package: 0805; Width: 0.049inch; Case Code (Metric): 2012; Packaging: Tape and Reel
U7 = LT1117CST-3.3#TRPBF: LT1117 - 800mA Low Dropout Positive Regulators Adjustable and Fixed 2.85V, 3.3V, 5V; MF: {'manufacturer': u'Analog Devices Inc.'}; Package: None; Price: None; Value: *; MP: LT1117CST-3.3#TRPBF; Availability: Unavailable
U8 = CMP-209535-000001-1: LDO Voltage Regulators 1A, 3.3V; Manufacturer: Advanced Monolithic Systems; Dropout Voltage: 1.1V; Output Type: Fixed; Nominal Supply Current: 5mA; Max Power Dissipation: 1.2W; Max Supply Voltage: 15V; Number Of Outputs: 1; Standoff Height: 0.64mm; Max Junction Temp: +125°C; Height: 1.8mm; Package: AMS1117; Device Class L2: Power Management ICs; ComponentLink2Description: Datasheet; ComponentLink2URL: http://www.advanced-monolithic.com/pdf/ds1117.pdf; Category: IC; RoHS: TRUE; Automotive: No; Device Class L1: Integrated Circuits (ICs); Output Current: 1A; Device Class L3: Voltage Regulators - Linear; Temperature: -40°C to +125°C; Output Voltage: 3.3V; Manufacturer Part Number: AMS1117-3.3; Temperature Range Low: -40°C; Octopart: https://octopart.com/ams1117-3.3-advanced+monolithic+systems-25899300; Lead Free: Yes; Ipc Land Pattern Name: SOT229P700X180-4; Temperature Range High: +125°C

## Nets that join several sheets
3V3: input_output (J1.3), input_signal_conditioning (R11.1 R15.1), logic (18 pins), LV_power (C49.2 U8.2 U8.4)
5V0: input_output (J2.16), input_signal_conditioning (6 pins), LV_power (7 pins)
DGND: cd_switching (6 pins), input_output (5 pins), logic (26 pins), LV_power (C49.1 C50.2 C51.2 U8.1)
GND: input_output (17 pins), input_signal_conditioning (14 pins), LV_power (5 pins)
PGND: cd_switching (14 pins), input_output (NT1.1 NT2.1 NT3.1 NT4.1), HV_power (28 pins)
ADC_SENSOR_1: input_output (J2.7), logic (R33.1)
EXT_SENSOR1_I2C_SCL: input_output (J2.5), logic (R36.2 U4.42)
EXT_SENSOR1_I2C_SDA: input_output (J2.6), logic (R34.2 U4.43)
FLYBACK_EN_L: cd_switching (Q3.3), HV_power (R43.1 U5.9)
FLYBACK_EN_R: cd_switching (Q4.3), HV_power (R56.2 U6.9)
IGNT_TRIG_L: cd_switching (U1.6), logic (U4.10)
IGNT_TRIG_R: cd_switching (U2.6), logic (U4.29)
KILL_SWITCH: input_output (J2.13), logic (C54.1 R68.1 U4.28)
L_COIL: cd_switching (C1.1), input_output (J2.1)
L_HV: cd_switching (C1.2 D11.1 Q1.4), HV_power (C37.2 D5.1 R40.2 R41.2)
LEFT_PULSE_3V3: input_signal_conditioning (R13.1), logic (U4.39)
LEFT_PULSE_P: input_output (J2.4), input_signal_conditioning (R9.2)
NetD6_1: logic (U4.45), HV_power (D6.1 R47.1 R51.2)
NetD8_1: logic (U4.46), HV_power (D8.1 R60.1 R64.2)
NRST: input_output (J1.12), logic (C55.1 R69.1 U4.7)
R_COIL: cd_switching (C6.1), input_output (J2.9)
R_HV: cd_switching (C6.2 D12.1 Q2.4), HV_power (C42.2 D7.1 R53.2 R54.2)
RIGHT_PULSE_3V3: input_signal_conditioning (R14.1), logic (U4.40)
RIGHT_PULSE_P: input_output (J2.3), input_signal_conditioning (R28.2)
SWCLK: input_output (J1.6), logic (U4.37)
SWDIO: input_output (J1.4), logic (U4.34)
UART_DEBUG_RX: input_output (J1.13 J2.18), logic (U4.31)
UART_DEBUG_TX: input_output (J1.14 J2.10), logic (U4.30)
VBAT: cd_switching (8 pins), input_output (7 pins), HV_power (14 pins), LV_power (C47.1 C48.1 U7.3)